# EAGLE schematic oresat0-minusz-end-cap (EAGLE 9.6.2)
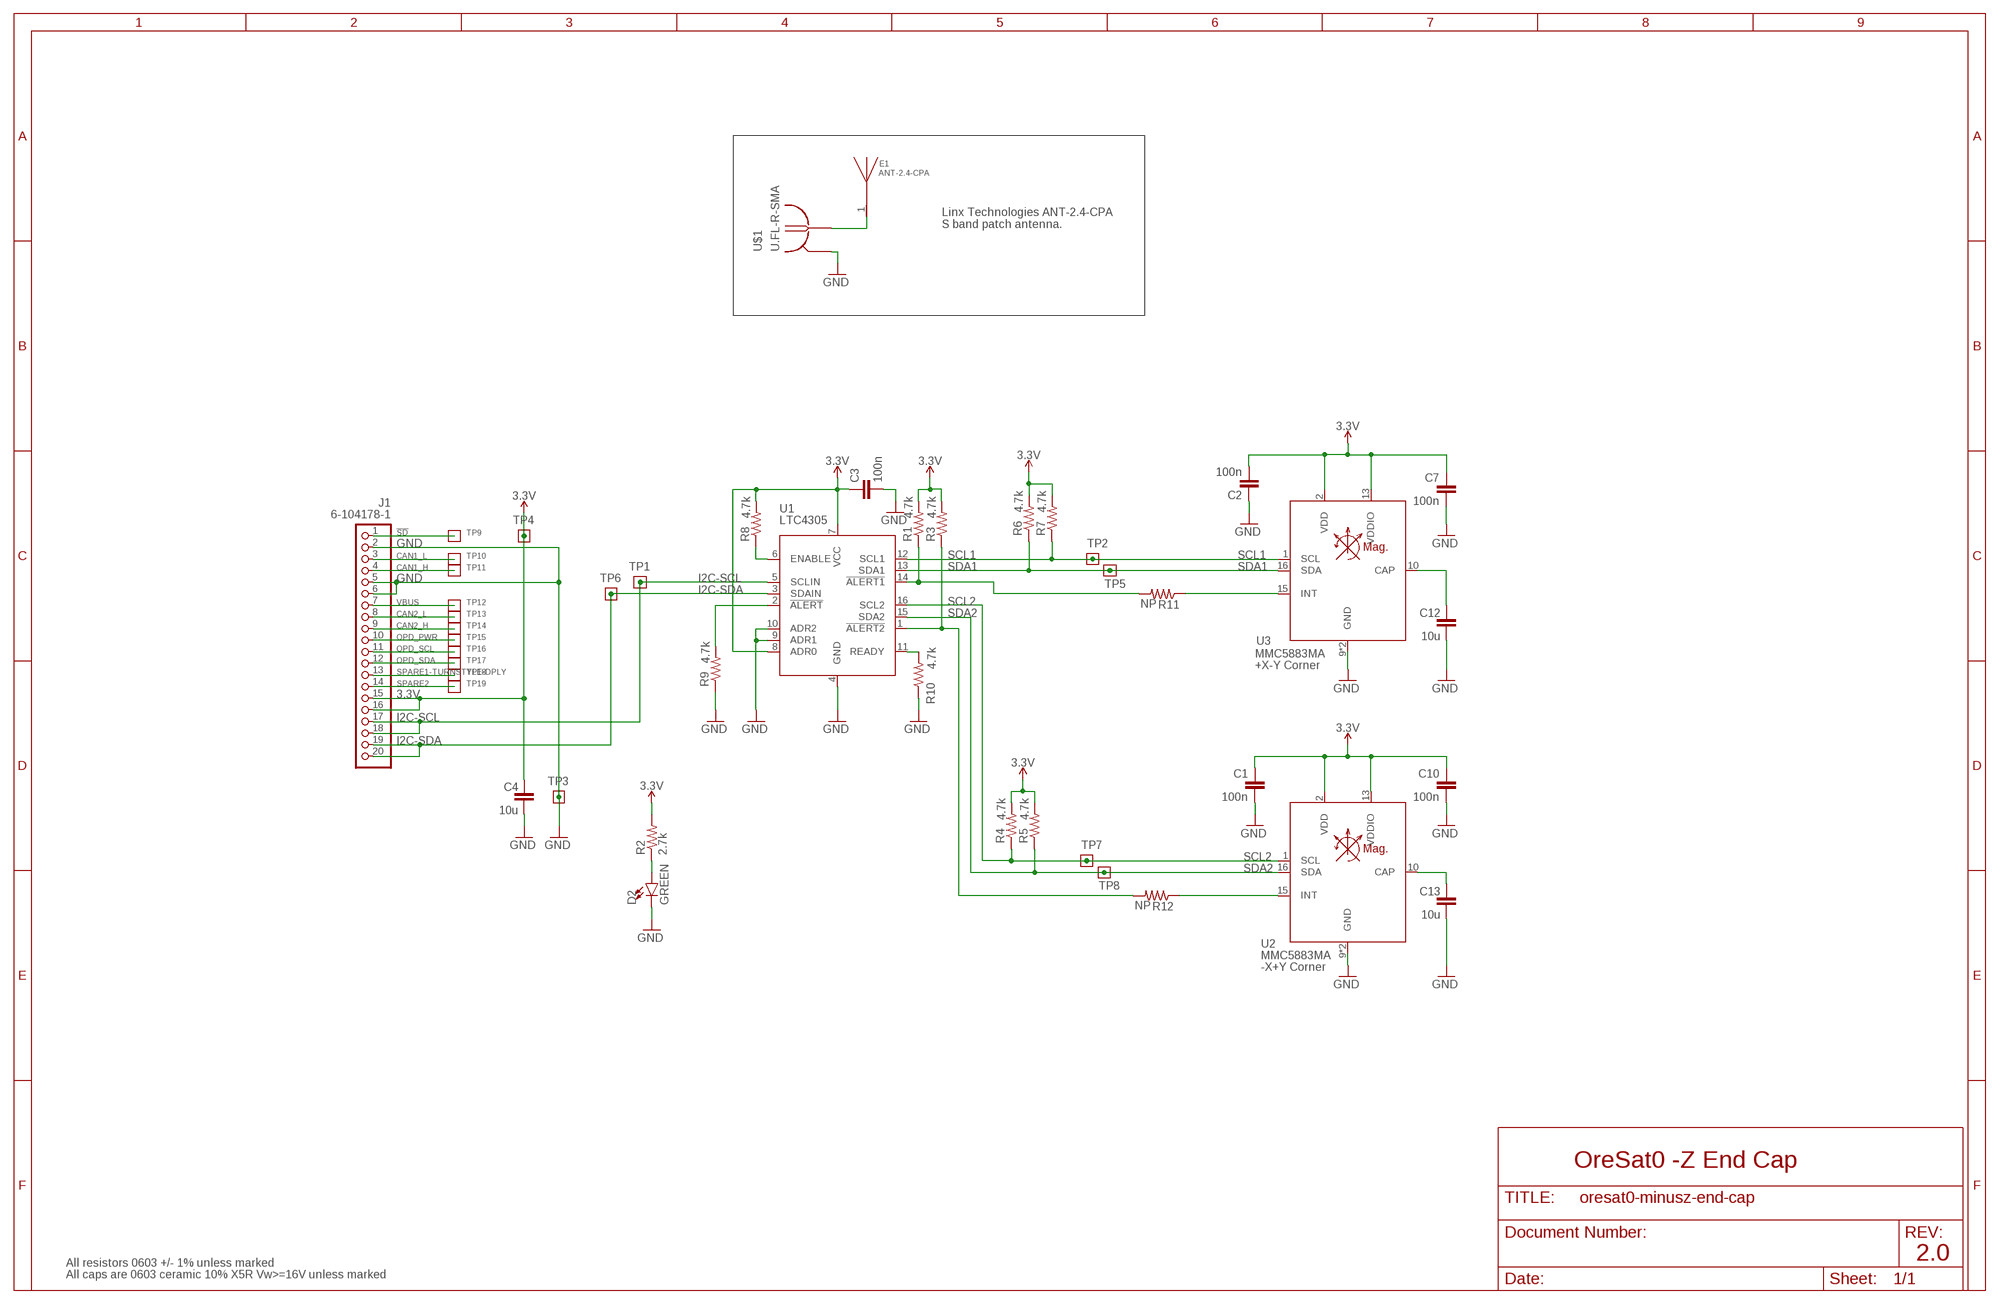
[diagram p0: schematic, sheet 1]

## Parts
C1  100n  C-EU0603-B-NOSILK  [.0603-B-NOSILK]
C2  100n  C-EU0603-B-NOSILK  [.0603-B-NOSILK]
C3  100n  C-EU0603-B-NOSILK  [.0603-B-NOSILK]
C4  10u  C-EU0603-B-NOSILK  [.0603-B-NOSILK]
C7  100n  C-EU0603-B-NOSILK  [.0603-B-NOSILK]
C10  100n  C-EU0603-B-NOSILK  [.0603-B-NOSILK]
C12  10u  C-EU0603-B-NOSILK  [.0603-B-NOSILK]
C13  10u  C-EU0603-B-NOSILK  [.0603-B-NOSILK]
D2  GREEN  LED-GREEN0603  [LED-0603]
E1  ANT-2.4-CPA  [XDCR_ANT-2.4-CPA]
J1  6-104178-1  [6-104178-1]
R1  4.7k  R-US_0603-B-NOSILK  [.0603-B-NOSILK]
R2  2.7k  R-US_0603-B-NOSILK  [.0603-B-NOSILK]
R3  4.7k  R-US_0603-B-NOSILK  [.0603-B-NOSILK]
R4  4.7k  R-US_0603-B-NOSILK  [.0603-B-NOSILK]
R5  4.7k  R-US_0603-B-NOSILK  [.0603-B-NOSILK]
R6  4.7k  R-US_0603-B-NOSILK  [.0603-B-NOSILK]
R7  4.7k  R-US_0603-B-NOSILK  [.0603-B-NOSILK]
R8  4.7k  R-US_0603-B-NOSILK  [.0603-B-NOSILK]
R9  4.7k  R-US_0603-B-NOSILK  [.0603-B-NOSILK]
R10  4.7k  R-US_0603-B-NOSILK  [.0603-B-NOSILK]
R11  NP  R-US_0603-B-NOSILK  [.0603-B-NOSILK]
R12  NP  R-US_0603-B-NOSILK  [.0603-B-NOSILK]
TP1  TEST-POINT-LARGE-SQUARE  [1X01]
TP2  TEST-POINT-LARGE-SQUARE  [1X01]
TP3  TEST-POINT-LARGE-SQUARE  [1X01]
TP4  TEST-POINT-LARGE-SQUARE  [1X01]
TP5  TEST-POINT-LARGE-SQUARE  [1X01]
TP6  TEST-POINT-LARGE-SQUARE  [1X01]
TP7  TEST-POINT-LARGE-SQUARE  [1X01]
TP8  TEST-POINT-LARGE-SQUARE  [1X01]
TP9  TEST-POINT-LARGE-SQUARE  [1X01]
TP10  TEST-POINT-LARGE-SQUARE  [1X01]
TP11  TEST-POINT-LARGE-SQUARE  [1X01]
TP12  TEST-POINT-LARGE-SQUARE  [1X01]
TP13  TEST-POINT-LARGE-SQUARE  [1X01]
TP14  TEST-POINT-LARGE-SQUARE  [1X01]
TP15  TEST-POINT-LARGE-SQUARE  [1X01]
TP16  TEST-POINT-LARGE-SQUARE  [1X01]
TP17  TEST-POINT-LARGE-SQUARE  [1X01]
TP18  TEST-POINT-LARGE-SQUARE  [1X01]
TP19  TEST-POINT-LARGE-SQUARE  [1X01]
U1  LTC4305  [16-SSOP]
U2  MMC5883MA  [LGA-16(3X3)]
U3  MMC5883MA  [LGA-16(3X3)]
U$1  U.FL-R-SMA  [U.FL-R-SMT]

## Nets
3.3V: C1.1 C2.2 C3.1 C4.1 C7.1 C10.1 J1.15 J1.16 R1.2 R2.2 R3.2 R4.2 R5.2 R6.2 R7.2 R8.2 TP4.1 U1.7(VCC) U1.8(ADR0) U2.2(VDD) U2.13(VDDIO) U3.2(VDD) U3.13(VDDIO)
!SD: J1.1 TP9.1
CAN1_H: J1.4 TP11.1
CAN1_L: J1.3 TP10.1
CAN2_H: J1.9 TP14.1
CAN2_L: J1.8 TP13.1
GND: C1.2 C2.1 C3.2 C4.2 C7.2 C10.2 C12.2 C13.2 D2.C J1.2 J1.5 J1.6 R9.1 R10.1 TP3.1 U1.4(GND) U1.9(ADR1) U1.10(ADR2) U2.9(GND) U2.11(GND) U3.9(GND) U3.11(GND) U$1.2 U$1.3
I2C-SCL: J1.17 J1.18 TP1.1 U1.5(SCLIN)
I2C-SDA: J1.19 J1.20 TP6.1 U1.3(SDAIN)
N$1: R8.1 U1.6(ENABLE)
N$2: C12.1 U3.10(CAP)
N$3: R1.1 R11.2 U1.14(!ALERT1)
N$4: R3.1 R12.2 U1.1(!ALERT2)
N$5: C13.1 U2.10(CAP)
N$6: R9.2 U1.2(!ALERT)
N$7: R10.2 U1.11(READY)
N$8: R11.1 U3.15(INT)
N$9: E1.1(FEED) U$1.1
N$10: R12.1 U2.15(INT)
N$271: D2.A R2.1
OPD_PWR: J1.10 TP15.1
OPD_SCL: J1.11 TP16.1
OPD_SDA: J1.12 TP17.1
SCL1: R7.1 TP2.1 U1.12(SCL1) U3.1(SCL)
SCL2: R4.1 TP7.1 U1.16(SCL2) U2.1(SCL)
SDA1: R6.1 TP5.1 U1.13(SDA1) U3.16(SDA)
SDA2: R5.1 TP8.1 U1.15(SDA2) U2.16(SDA)
SPARE1-TURNSTYLE-DPLY: J1.13 TP18.1
SPARE2: J1.14 TP19.1
VBUS: J1.7 TP12.1

## Notes on the sheet
- Linx Technologies ANT-2.4-CPA 
  S band patch antenna.
- +X-Y Corner
- -X+Y Corner
- OreSat0 -Z End Cap
- 2.0
- All resistors 0603 +/- 1% unless marked
- All caps are 0603 ceramic 10% X5R Vw>=16V unless marked

## Library data of the parts
C1-C3 C7 C10 = oresat-rcl:C-EU: CAPACITOR, European symbol; DIS: Digi-Key; DPN: 1276-CL10B104KB8NNNLCT-ND; MFR: Samsung; MPN: CL10B104KB8NNNL
C4 C12 C13 = oresat-rcl:C-EU: CAPACITOR, European symbol; DIS: Digi-Key; DPN: 490-14461-1-ND; MFR: Murata; MPN: GRM188D71A106KA73D
D2 = SparkFun-LED:LED-GREEN: Green SMD LED Used in manufacturing of various products at SparkFun Packages: 0603 - SMD 0603 package [Product Link] <http://www.futureelectronics.com/en/technologies/semiconductors/optoelectronics/leds/Pages/9894312-LTST-C190GKT.aspx?CrossPart=HSMG-C190&IM=0> LilyPad 1206 - SMD1206 LilyPad package [Product Link] <http://www.futureelectronics.com/en/Technologies/Product.aspx?ProductID=IN150NGHARVATEKCORPORATION2049943&IM=0> 1206 - SMD1206 package [Product Link] <http://www.futureelectronics.com/en/technologies/semiconductors/optoelectronics/leds/Pages/8315665-LTST-C150KGKT.aspx?IM=0> 1206 Bottom Mount -SMD 1206 Bottom Mount [Product Link] <http://www.digikey.com/product-detail/en/lite-on-inc/LTST-C230KGKT/160-1456-1-ND/386854> SparkFun Products: Pro Mini 328 -5V <https://www.sparkfun.com/products/821> RedBoard <https://www.sparkfun.com/products/12757> MP3 Trigger <https://www.sparkfun.com/products/13720> Makey Makey <https://www.sparkfun.com/products/11076>; DIS: Digi-Key; DPN: 511-1584-1-ND; MFR: Rohm; MPN: SML-E12M8WT86; PROD_ID: DIO-00821
E1 = ANT-Ethertonics-2.4-CPA:ANT-2.4-CPA: RF ANT 2.4GHZ PATCH ISM 20X20; DESCRIPTION: 2400 MHz Radiating Patch Ceramic Patch Antenna; DIGI-KEY_PART_NUMBER: 343-ANT-2.4-CPA-ND; MF: Linx Technologies; MP: ANT-2.4-CPA; PACKAGE: None; PURCHASE-URL: https://pricing.snapeda.com/search/part/ANT-2.4-CPA/?ref=eda
J1 = J-TE-6-104178-1-1.27mm-male-th:6-104178-1; DIS: Digi-Key; DPN: 952-3875-1-ND; MFR: TE Connectivity; MPN: 6-104178-1
R1 R3-R10 = oresat-rcl:R-US_: RESISTOR, American symbol; DIS: Digi-Key; DPN: A12969CT-ND; MFR: TE Connectivity; MPN: CRGCQ0603F4K7
R2 = oresat-rcl:R-US_: RESISTOR, American symbol; DIS: Digi-Key; DPN: A129693CT-ND; MFR: TE Connectivity; MPN: CRGCQ0603F2K7
R11 R12 = oresat-rcl:R-US_: RESISTOR, American symbol
TP1-TP19 = oresat-misc:TEST-POINT-LARGE-SQUARE
U1 = U-Linear-LTC4305-2-Channel-Bus-Multiplexer:LTC4305; DIS: Digi-Key; DPN: LTC4305IGN#PBF-ND; MFR: Analog; MPN: LTC4305IGN#PBF
U2 U3 = U-Memsic-MMC5883-3-Axis-Magnetometer:MMC5883MA; DIS: Digi-Key; DPN: 1267-1072-1-ND; MFR: Memsic; MPN: MMC5883MA
U$1 = J-HRS-U.FL-R-SMT-1(10)-M-RF:U.FL-R-SMA: Male SMA U.FL Connector: https://www.mouser.com/ProductDetail/Hirose-Connector/UFL-R-SMT-110?qs=kL1ClTr6oBoOdtqlGQpQrQ%3D%3D